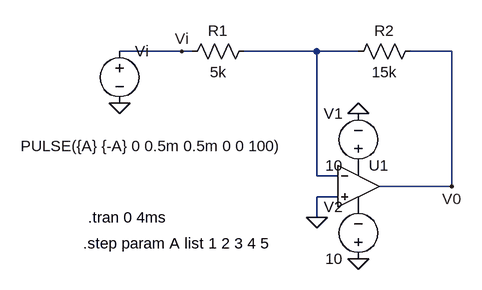
[diagram p0: schematic tut2ques20b.asc]
tut2ques20b.asc, the LTspice schematic file:
Version 4
SHEET 1 880 680
WIRE -80 -32 -176 -32
WIRE -64 -32 -80 -32
WIRE 128 -32 16 -32
WIRE 192 -32 128 -32
WIRE 336 -32 272 -32
WIRE 128 160 128 -32
WIRE 160 160 128 160
WIRE 336 176 336 -32
WIRE 336 176 224 176
WIRE 160 192 128 192
WIRE 128 224 128 192
FLAG 128 224 0
FLAG 336 176 V0
FLAG 192 64 0
FLAG 192 288 0
FLAG -176 48 0
FLAG -80 -32 Vi
SYMBOL OpAmps\\UniversalOpAmp2 192 176 R0
SYMATTR InstName U1
SYMATTR SpiceLine Ilimit=25m Rail=1 Vos=0
SYMBOL res 32 -48 R90
WINDOW 0 0 56 VBottom 2
WINDOW 3 32 56 VTop 2
SYMATTR InstName R1
SYMATTR Value 5k
SYMBOL res 288 -48 R90
WINDOW 0 0 56 VBottom 2
WINDOW 3 32 56 VTop 2
SYMATTR InstName R2
SYMATTR Value 15k
SYMBOL voltage 192 160 R180
WINDOW 0 24 96 Left 2
WINDOW 3 24 16 Left 2
WINDOW 123 0 0 Left 0
WINDOW 39 0 0 Left 0
SYMATTR InstName V1
SYMATTR Value 10
SYMBOL voltage 192 304 R180
WINDOW 0 24 96 Left 2
WINDOW 3 24 16 Left 2
WINDOW 123 0 0 Left 0
WINDOW 39 0 0 Left 0
SYMATTR InstName V2
SYMATTR Value 10
SYMBOL voltage -176 -48 R0
WINDOW 3 -152 162 Left 2
SYMATTR Value PULSE({A} {-A} 0 0.5m 0.5m 0 0 100)
SYMATTR InstName Vi
TEXT -224 224 Left 2 !.tran 0 4ms
TEXT -232 264 Left 2 !.step param A list 1 2 3 4 5

The netlist it stands for:
* tut2ques20b.asc
XU1 0 N001 P001 P002 V0 level2 Avol=1Meg GBW=10Meg Slew=10Meg Ilimit=25m Rail=1 Vos=0 En=0 Enk=0 In=0 Ink=0 Rin=500Meg  ; pins In+ In- V+ V- OUT
R1 N001 Vi 5k
R2 V0 N001 15k
V1 P001 0 10
V2 0 P002 10
Vi Vi 0 PULSE({A} {-A} 0 0.5m 0.5m 0 0 100)
.tran 0 4ms
.step param A list 1 2 3 4 5
.lib UniversalOpAmp2.lib
.backanno
.end